# Altium schematic sheet REF5050.SchDoc
size A4
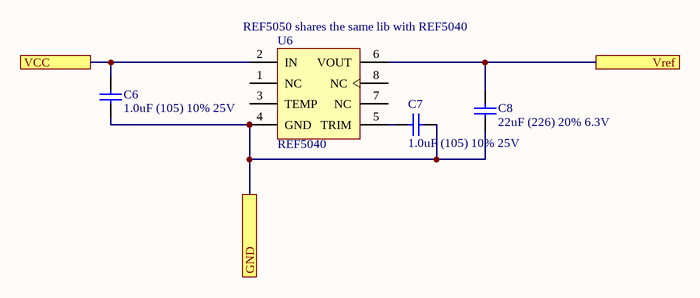
[diagram p0: REF5050.SchDoc]

## Parts
C6  1.0uF (105) 10% 25V  [0402_C]
C7  1.0uF (105) 10% 25V  [0402_C]
C8  22uF (226) 20% 6.3V  [0603_C]
U6  REF5040  [SOP8_N]

## Ports
GND, VCC, Vref

## Nets
GND: C6.1 C7.2 C8.1 U6.4(GND) ; port GND
VCC: C6.2 U6.2(IN) ; port VCC
Vref: C8.2 U6.6(VOUT) ; port Vref
NetC7_1: C7.1 U6.5(TRIM)

Not connected (* = marked no-connect by the designer): U6 1(NC) 3(TEMP) 7(NC) 8(NC)

## Notes on the sheet
- (near U6) REF5050 shares the same lib with REF5040

## Library data of the parts
C6 C7 = 0402 1.0uF (105) 10% 25V: 贴片电容; ComponentLink1Description: 供应商链接; ComponentLink1URL: http://www.szlcsc.com/product/details_53938.html; Package: 0402; Supplier: LC; SuppliersPartNumber: C52923
C8 = 0603 22uF (226) 20% 6.3V: 贴片电容; ComponentLink1Description: 供应商链接; ComponentLink1URL: http://www.szlcsc.com/product/details_60514.html; Package: 0603; Supplier: LC; SuppliersPartNumber: C59461
U6 = REF5040: 高精度电压基准; 版权归属: 源创客; BOM名称: 高精度电压基准; 学习资源: www.ooocke.com